# EAGLE board Project_TSC (EAGLE 9.7.0)
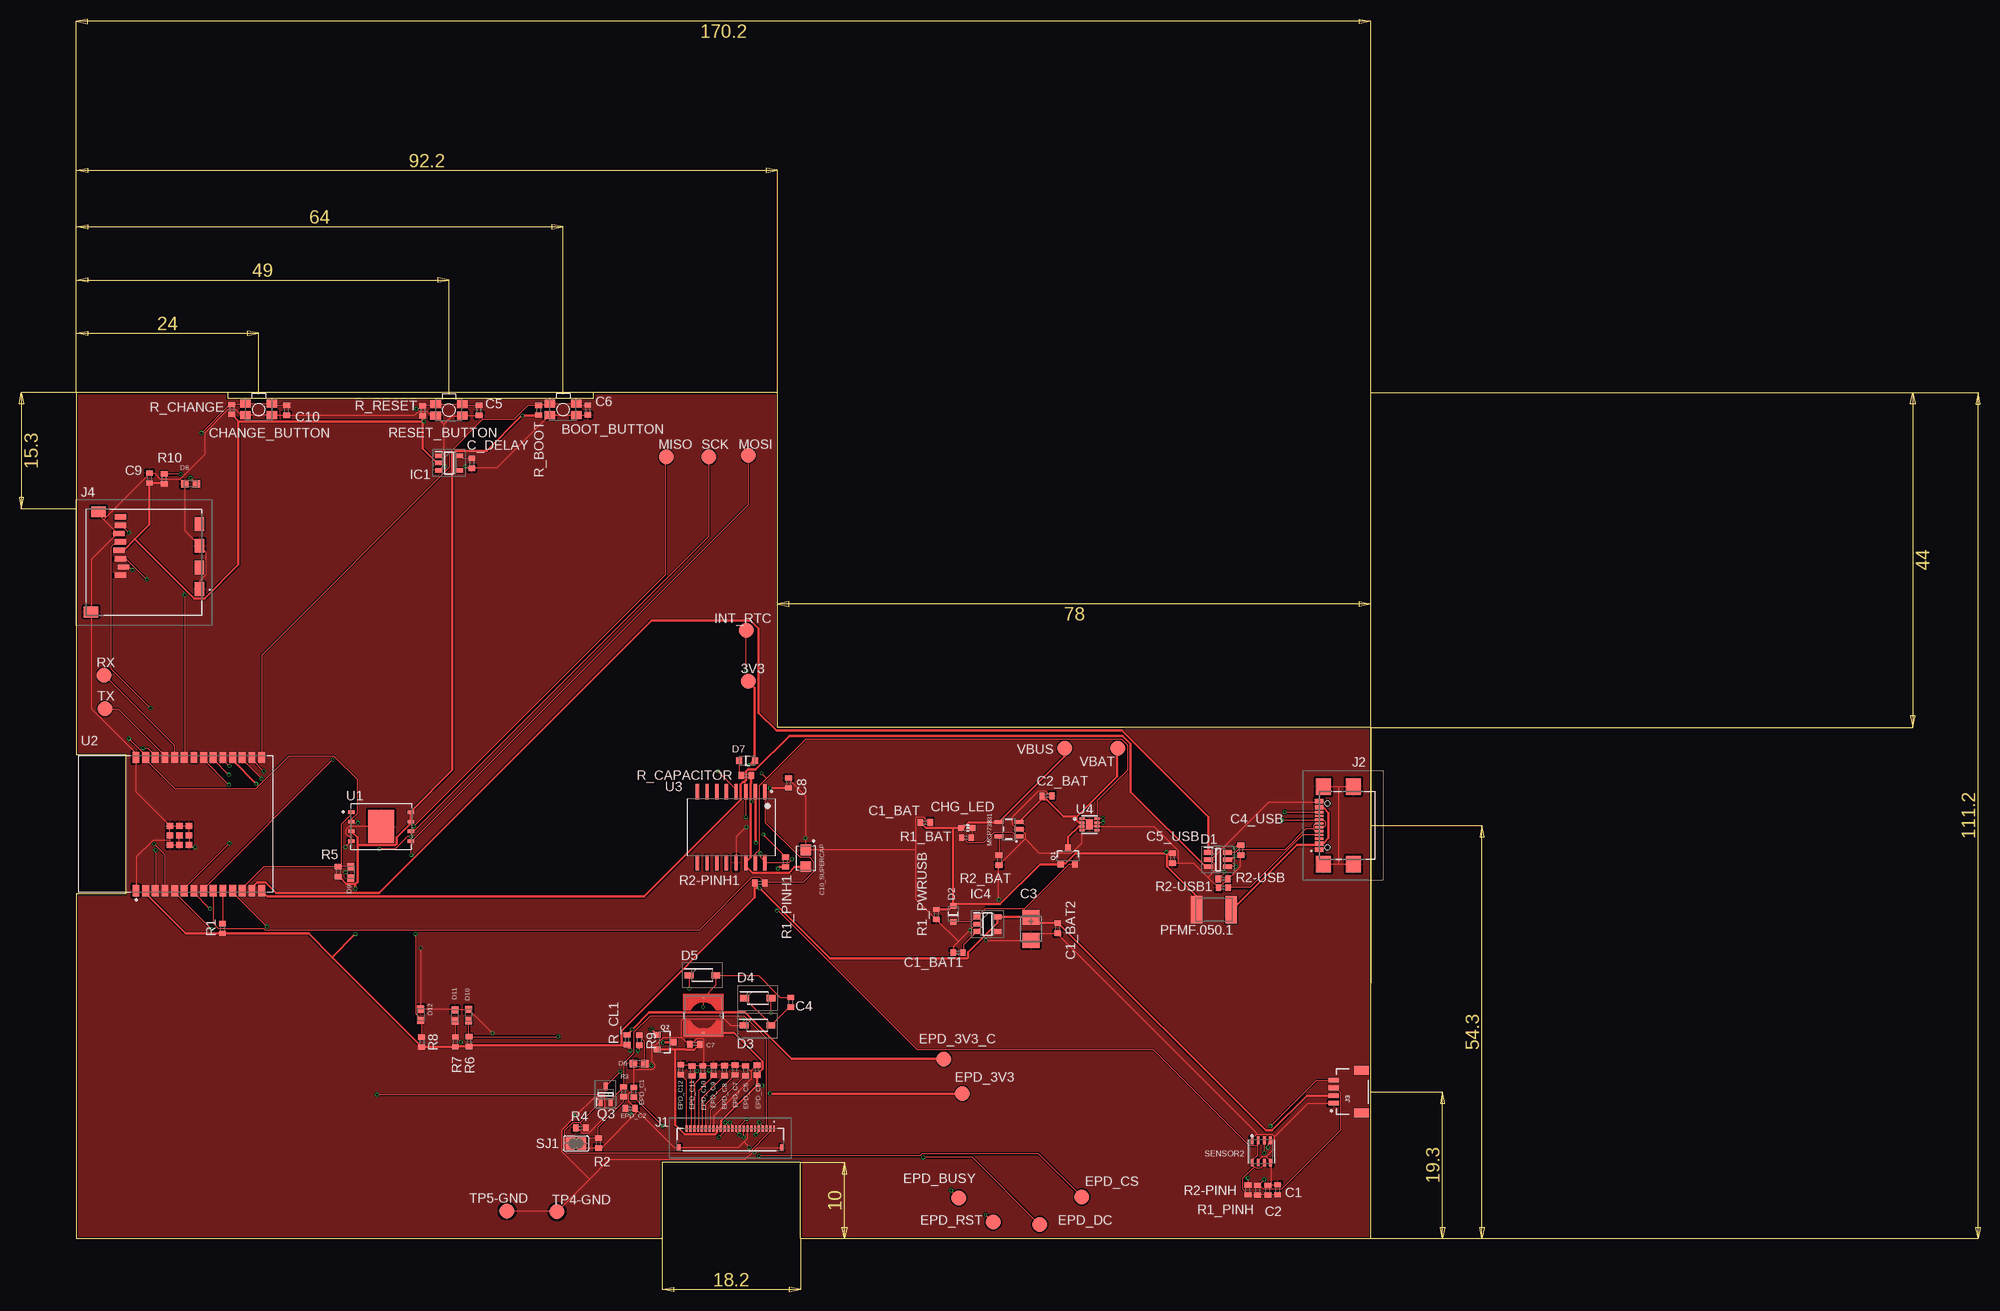
[diagram p1: board, top side]
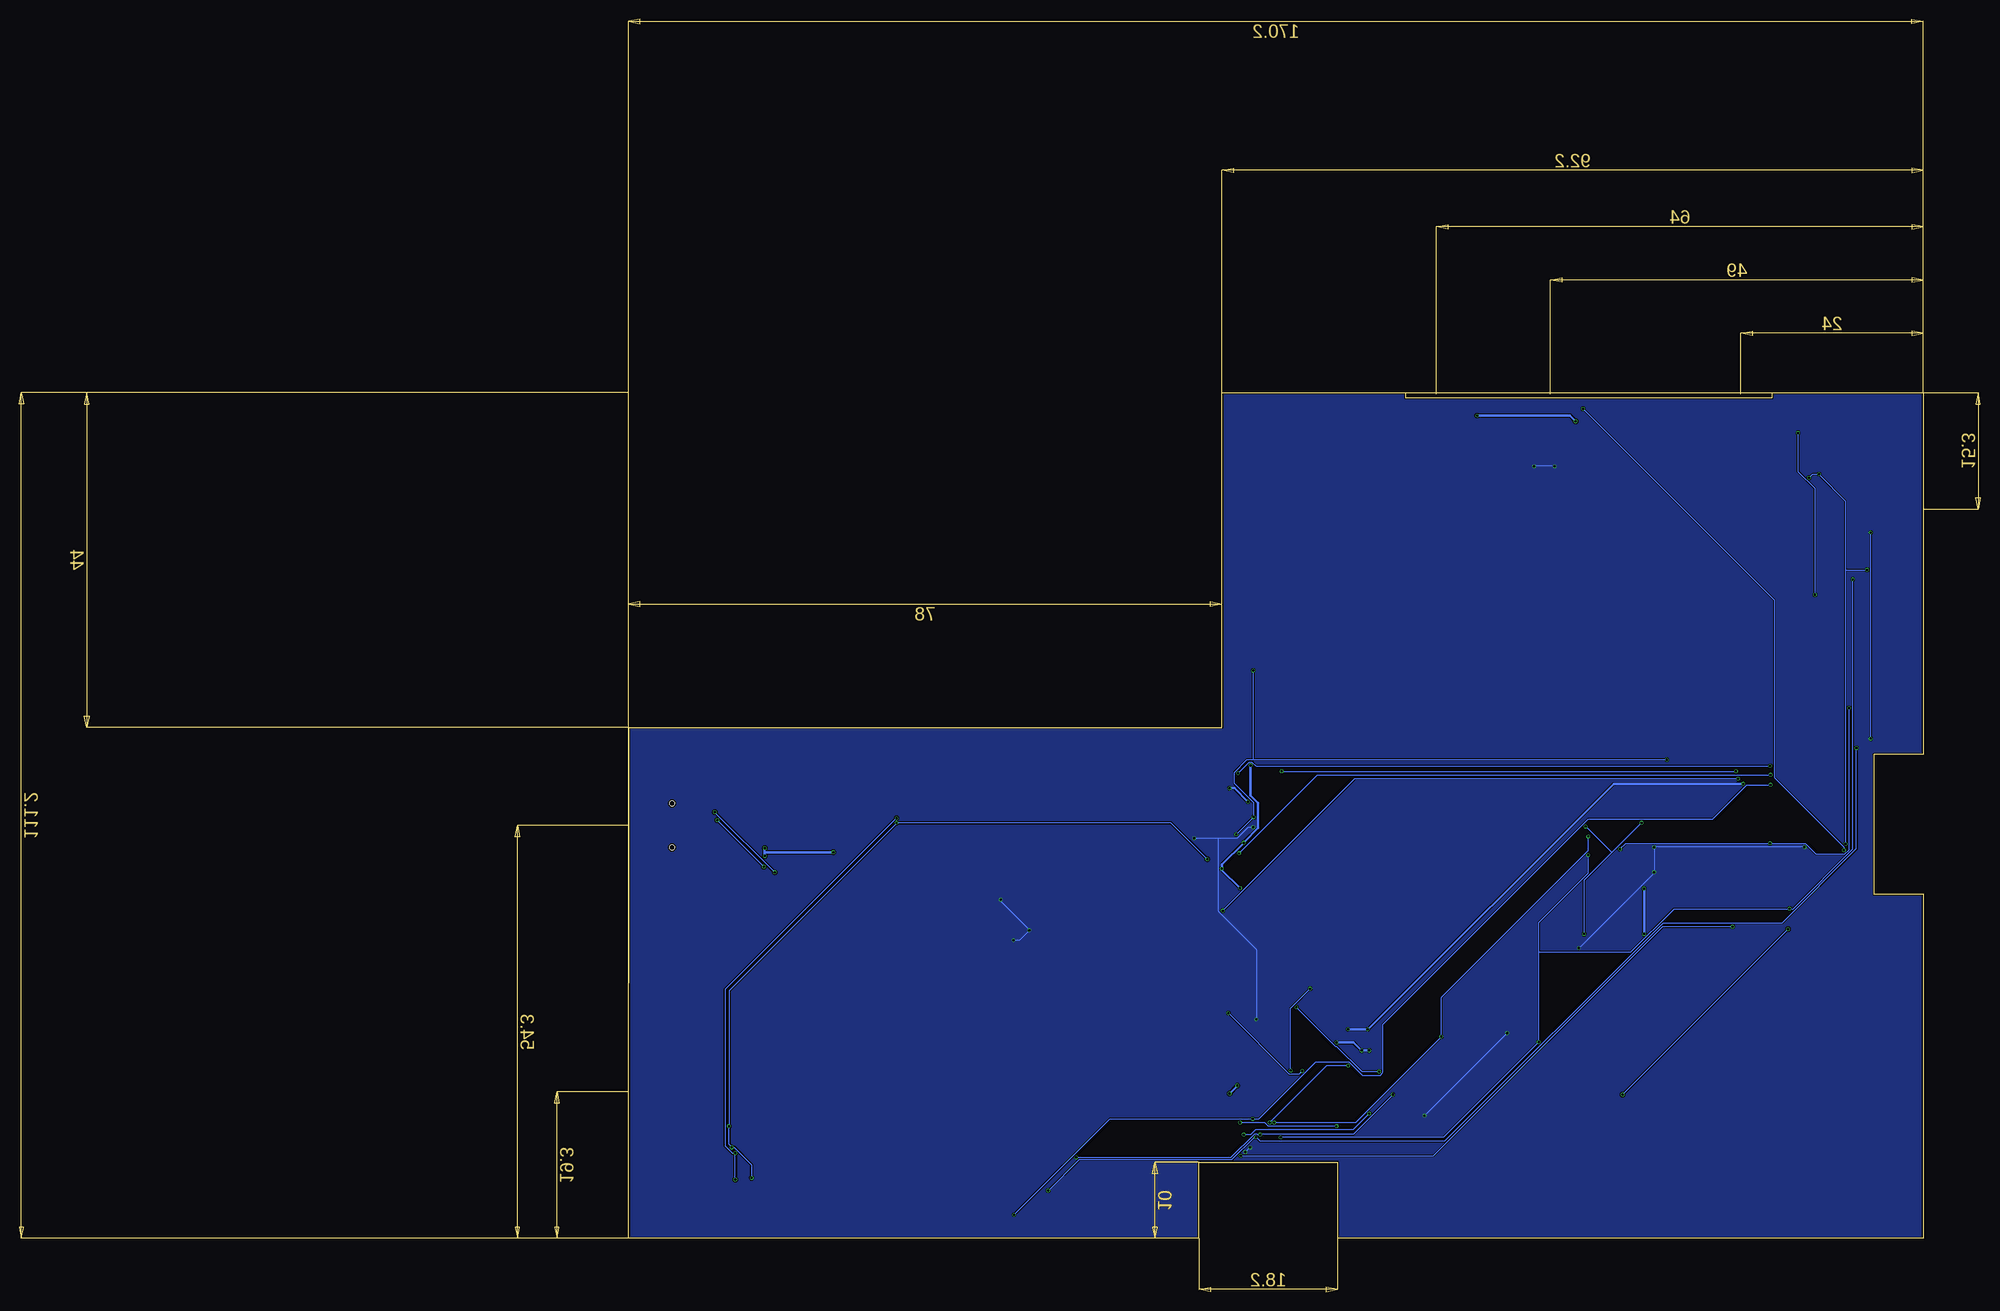
[diagram p2: board, bottom side, seen from below]

Size 170.2 x 111.2 mm. Coordinates in mm from the lower left corner, seen from the top.
Outline: 170.2,67.2 170.2,0 95.2,0 95.2,10 77,10 77,0 0,0 0,45.3 6.5,45.3 6.5,63.6 0,63.6 0,111.2 19.9,111.2
Outline: 170.2,67.2 170.2,111.2
Outline: 68,111.2 92.2,111.2 92.2,67.2 170.2,67.2
Outline: 68,111.2 19.9,111.2
Outline: 19.9,111.2 19.9,110.5 68,110.5 68,111.2
Copper layers (1*16): Top / Bottom
Stack-up Default Layer Stack: Top User Defined 0.035mm / Dielectric-1 User Defined 1.6mm / Bottom User Defined 0.035mm
Design rules: minimum copper width classes=0 0.15mm, minimum copper width classes=1 0.3mm, minimum copper width 5mil, minimum drill size 0.3mm, copper clearance wire_polygon to wire_polygon 5mil, copper clearance wire_polygon to pad_smd 5mil, copper clearance wire_polygon to via 5mil, copper clearance pad_smd to pad_smd 5mil, copper clearance pad_smd to via 5mil, copper clearance via to via 5mil, copper clearance smd to pad (same net) 5mil, copper clearance smd to via (same net) 5mil, copper clearance smd to smd (same net) 5mil, dimension clearance 0.2mm, via restrict clearance 0mil, restrict clearance 0mil, drill distance 6mil, keepout clearance 0mil
Net classes: 0 default: width 0.15 mm; 1 Power: width 0.3 mm

## Footprints (pad centres in the part's own frame; a part is rotated, then mirrored left to right if it is on the bottom)
TP20R = smd 2 x 2: TP 0,0
MYBUTTON = smd 1.4 x 1.05: 1 1.75,0.75; 2 -1.75,0.75; 3 -1.75,-0.75; 4 1.75,-0.75
EAGLE-LTSPICE_C0402 = smd 0.7 x 0.9: 1 -0.65,0; 2 0.65,0
RCL_CT3528 = smd 2 x 2.2: + -1.5,0; - 1.5,0
CAPCP3225X100N = smd 1.4 x 1.4: 1 -1.1,0; 2 1.1,0
ADAFRUIT_CHIP-LED0603 = smd 0.8 x 0.8: A 0,-0.75; C 0,0.75
SOT95P280X145-6N = smd 1.2 x 0.6: 1 -1.25,0.95; 2 -1.25,0; 3 -1.25,-0.95; 4 1.25,-0.95; 5 1.25,0; 6 1.25,0.95
ESP32_WROVER_AVX---SD0805S020S1R0_AVX_SD0805S020S1R0_0 = smd 0.8 x 0.9: 1 -1.05,0; 2 1.05,0
SOD3716X135N = smd 1.15 x 0.8: 1 -1.75,0; 2 1.75,0
DIOC1608X36N = smd 0.97 x 0.94: 1 -0.75,0; 2 0.75,0
SOT95P280X120-5N = smd 0.9 x 0.6: 1 -1.4,0.95; 2 -1.4,0; 3 -1.4,-0.95; 4 1.4,-0.95; 5 1.4,0.95
FH34SRJ24S05SH99 = smd 0.3 x 0.8: 1 5.75,1.45; 2 5.25,1.45; 3 4.75,1.45; 4 4.25,1.45; 5 3.75,1.45; 6 3.25,1.45; 7 2.75,1.45; 8 2.25,1.45; 9 1.75,1.45; 10 1.25,1.45; 11 0.75,1.45; 12 0.25,1.45; 13 -0.25,1.45; 14 -0.75,1.45; 15 -1.25,1.45; 16 -1.75,1.45; 17 -2.25,1.45; 18 -2.75,1.45; 19 -3.25,1.45; 20 -3.75,1.45; 21 -4.25,1.45; 22 -4.75,1.45; 23 -5.25,1.45; 24 -5.75,1.45 | smd 0.4 x 0.8: MP1 6.75,-1.05; MP2 -6.75,-1.05
SAMACSYS_PARTS_USB4110GFA = smd 0.3 x 1.15: A1 -3.35,3.678; A4 -2.55,3.678; A5 -1.25,3.678; A6 -0.25,3.678; A7 0.25,3.678; A8 1.25,3.678; A9 2.55,3.678; A12 3.35,3.678; B1 3.05,3.678; B4 2.25,3.678; B5 1.75,3.678; B6 0.75,3.678; B7 -0.75,3.678; B8 -1.75,3.678; B9 -2.25,3.678; B12 -3.05,3.678 | smd 2.18 x 2: MP1 -5.11,-0.827; MP2 5.11,-0.827; MP3 -5.11,3.103; MP4 5.11,3.103 | hole 0.65: -2.89,2.603; 2.89,2.603
JST04_1MM_RA = smd 0.6 x 1.35: 1 -1.5,0; 2 -0.5,0; 3 0.5,0; 4 1.5,0 | smd 1.2 x 2: NC1 2.8,-3.675; NC2 -2.8,-3.675
112ATAARR03ATTEND = smd 1.8 x 1.2: G1 10.6,10.4; G2 4.9,10.4; S1 7.75,10.4; S2 2.05,10.4 | smd 1.4 x 1.9: G3 13.6,-3.85; G4 0.45,-2.85 | smd 0.7 x 1.5: P1 8.8,0; P2 7.7,0.4; P3 6.6,0; P4 5.5,-0.2; P5 4.4,0; P6 3.3,-0.2; P7 2.2,0; P8 1.1,0
IND_4828-WE-TPC_WRE = smd 0.152 x 0.152: 1 -2.286,0 | smd 0.3 x 0.3: 2 2.286,0
ESP32_WROVER_SPARKFUN-IC-POWER_SOT23-5 = smd 0.55 x 1.2: 1 -0.95,-1.3; 2 0,-1.3; 3 0.95,-1.3; 4 0.95,1.3; 5 -0.95,1.3
ESP32C6_VARISTOR_CT/CN1812 = smd 1.5 x 3.6: 1 -2.25,0; 2 2.25,0
ESP32_WROVER_SPARKFUN-DISCRETESEMI_SOT23-3 = smd 0.8 x 0.9: 1 -0.95,-1; 2 0.95,-1; 3 0,1.1
SOT65P210X110-3N = smd 1.05 x 0.5: 1 -1.05,0.65; 2 -1.05,-0.65; 3 1.05,0
ESP32_WROVER_EAGLE-LTSPICE_R0402 = smd 0.7 x 0.9: 1 -0.65,0; 2 0.65,0
ESP32_WROVER_BME680_PSON80P300X300X100-8N = smd 1.016 x 0.5: 1 1.458,1.2; 2 1.458,0.4; 3 1.458,-0.4; 4 1.458,-1.2; 5 -1.458,-1.22; 6 -1.458,-0.4; 7 -1.458,0.4; 8 -1.458,1.2
SJ = smd 1.168 x 1.6: 1 -0.762,0; 2 0.762,0
SON127P600X800X80-9N = smd 0.94 x 0.44: 1 -3.895,1.905; 2 -3.895,0.635; 3 -3.895,-0.635; 4 -3.895,-1.905; 5 3.895,-1.905; 6 3.895,-0.635; 7 3.895,0.635; 8 3.895,1.905 | smd 3.4 x 4.3: 9 0,0
XCVR_ESP32-C6-WROOM-1-N8 = smd 1.5 x 0.9: 1 -8.75,5.26; 2 -8.75,3.99; 3 -8.75,2.72; 4 -8.75,1.45; 5 -8.75,0.18; 6 -8.75,-1.09; 7 -8.75,-2.36; 8 -8.75,-3.63; 9 -8.75,-4.9; 10 -8.75,-6.17; 11 -8.75,-7.44; 12 -8.75,-8.71; 13 -8.75,-9.98; 14 -8.75,-11.25; 15 8.75,-11.25; 16 8.75,-9.98; 17 8.75,-8.71; 18 8.75,-7.44; 19 8.75,-6.17; 20 8.75,-4.9; 21 8.75,-3.63; 22 8.75,-2.36; 23 8.75,-1.09; 24 8.75,0.18; 25 8.75,1.45; 26 8.75,2.72; 27 8.75,3.99; 28 8.75,5.26 | smd 0.8 x 0.8: 29_1 -2.755,0.79; 29_2 -1.505,0.79; 29_3 -0.255,0.79; 29_4 -2.755,-0.46; 29_5 -1.505,-0.46; 29_6 -0.255,-0.46; 29_7 -2.755,-1.71; 29_8 -1.505,-1.71; 29_9 -0.255,-1.71
SOIC127P1032X265-16N = smd 2.05 x 0.59: 1 -4.655,4.445; 2 -4.655,3.175; 3 -4.655,1.905; 4 -4.655,0.635; 5 -4.655,-0.635; 6 -4.655,-1.905; 7 -4.655,-3.175; 8 -4.655,-4.445; 9 4.655,-4.445; 10 4.655,-3.175; 11 4.655,-1.905; 12 4.655,-0.635; 13 4.655,0.635; 14 4.655,1.905; 15 4.655,3.175; 16 4.655,4.445
SON50P200X200X80-9N = smd 0.76 x 0.27: 1 -0.985,0.75; 4 -0.985,-0.75; 5 0.985,-0.75; 6 0.985,-0.25; 7 0.985,0.25; 8 0.985,0.75 | smd 0.76 x 0.31: 2 -0.985,0.25; 3 -0.985,-0.25 | smd 0.9 x 1.3: 9 0,0

## Placement (x,y rotation side)
3V3  TPTP20R  [TP20R]  88.35,73.24 0 top
BOOT_BUTTON  BOOT_BUTTON  [MYBUTTON]  64,108.97 180 top
C1  100nF  [EAGLE-LTSPICE_C0402]  157.92,6.4 90 top
C1_BAT  4.7uF  [EAGLE-LTSPICE_C0402]  111.6,54.68 0 top
C1_BAT1  4.7uF  [EAGLE-LTSPICE_C0402]  115.93,37.58 180 top
C1_BAT2  4.7uF  [EAGLE-LTSPICE_C0402]  129.02,40.79 270 top
C2  100nF  [EAGLE-LTSPICE_C0402]  156.64,6.35 90 top
C2_BAT  4.7uF  [EAGLE-LTSPICE_C0402]  127.61,58.18 0 top
C3  100uF TANT  [RCL_CT3528]  125.5,40.69 270 top
C4  4.7uF/25V  [EAGLE-LTSPICE_C0402]  93.94,31.05 90 top
C4_USB  100nF  [EAGLE-LTSPICE_C0402]  153.1,51.05 270 top
C5  1uF  [EAGLE-LTSPICE_C0402]  52.97,108.87 270 top
C5_USB  4.7uF  [EAGLE-LTSPICE_C0402]  144.1,49.99 270 top
C6  100nF  [EAGLE-LTSPICE_C0402]  67.26,108.9 270 top
C7  10uF  [EAGLE-LTSPICE_C0402]  81.31,25.54 180 top
C8  100nF  [EAGLE-LTSPICE_C0402]  93.64,59.88 90 top
C9  100nF  [EAGLE-LTSPICE_C0402]  9.64,99.96 90 top
C10  100nF  [EAGLE-LTSPICE_C0402]  27.66,108.86 270 top
C10_SUPERCAP  CPH3225A  [CAPCP3225X100N]  95.92,49.98 270 top
C_DELAY  100nF  [EAGLE-LTSPICE_C0402]  52.02,101.89 270 top
CHANGE_BUTTON  CHANGE_BUTTON  [MYBUTTON]  24,108.97 180 top
CHG_LED  [ADAFRUIT_CHIP-LED0603]  117.05,53.96 270 top
D1  USBLC6-2SC6Y  [SOT95P280X145-6N]  150.09,49.8 0 top
D2  ESP32_WROVER_AVX---SD0805S020S1R0_AVX_SD0805S020S1R0_0_0AVX_SD0805S020S1R0_0_0  [ESP32_WROVER_AVX---SD0805S020S1R0_AVX_SD0805S020S1R0_0]  115.29,42.65 90 top
D3  MBR0530  [SOD3716X135N]  89.56,28 0 top
D4  MBR0530  [SOD3716X135N]  89.6,31.6 0 top
D5  MBR0530  [SOD3716X135N]  82.32,34.61 0 top
D6  PGB1010603MR  [DIOC1608X36N]  73.98,23 0 top
D7  ESP32_WROVER_AVX---SD0805S020S1R0_AVX_SD0805S020S1R0_0_0AVX_SD0805S020S1R0_0_0  [ESP32_WROVER_AVX---SD0805S020S1R0_AVX_SD0805S020S1R0_0]  88.2,62.81 0 top
D8  PGB1010603MR  [DIOC1608X36N]  15.06,99.2 0 top
D9  PGB1010603MR  [DIOC1608X36N]  36.11,48.14 90 top
D10  PGB1010603MR  [DIOC1608X36N]  51.6,29.37 270 top
D11  PGB1010603MR  [DIOC1608X36N]  49.8,29.3 270 top
D12  PGB1010603MR  [DIOC1608X36N]  45.3,29.42 270 top
EPD_3V3  TPTP20R  [TP20R]  116.5,19.04 0 top
EPD_3V3_C  TPTP20R  [TP20R]  114.07,23.57 0 top
EPD_BUSY  TPTP20R  [TP20R]  116.01,5.32 0 top
EPD_C1  1uF/50V  [EAGLE-LTSPICE_C0402]  73.3,19.22 90 top
EPD_C2  1uF/50V  [EAGLE-LTSPICE_C0402]  72.83,17.1 0 top
EPD_C5  1uF/50V  [EAGLE-LTSPICE_C0402]  89.5,22.14 90 top
EPD_C6  1uF/50V  [EAGLE-LTSPICE_C0402]  88,22.05 90 top
EPD_C7  1uF/50V  [EAGLE-LTSPICE_C0402]  86.6,22.16 90 top
EPD_C8  1uF/50V  [EAGLE-LTSPICE_C0402]  85.22,22.08 90 top
EPD_C9  1uF/50V  [EAGLE-LTSPICE_C0402]  83.82,22.09 90 top
EPD_C10  1uF/50V  [EAGLE-LTSPICE_C0402]  82.38,22.05 90 top
EPD_C11  1uF/50V  [EAGLE-LTSPICE_C0402]  80.98,22.03 90 top
EPD_C12  1uF/50V  [EAGLE-LTSPICE_C0402]  79.48,22.19 90 top
EPD_CS  TPTP20R  [TP20R]  132.2,5.44 0 top
EPD_DC  TPTP20R  [TP20R]  126.65,1.84 0 top
EPD_RST  TPTP20R  [TP20R]  120.55,2.14 0 top
IC1  BD5229G-TR  [SOT95P280X120-5N]  49.03,101.95 0 top
IC4  XC6220A331MR-G  [SOT95P280X120-5N]  119.77,41.32 0 top
INT_RTC  TPTP20R  [TP20R]  88.1,79.94 0 top
J1  FH34SRJ-24S-0.5SH_99_  [FH34SRJ24S05SH99]  86,13 0 top
J2  SAMACSYS_PARTS_USB4110-GF-A  [SAMACSYS_PARTS_USB4110GFA]  167.06,54.3 90 top
J3  QWIIC_RIGHT_ANGLE  [JST04_1MM_RA]  165.28,19.3 90 top
J4  112A-TAAR-R03_ATTEND  [112ATAARR03ATTEND]  5.82,95.96 270 top
L1  68uH  [IND_4828-WE-TPC_WRE]  82.45,29.33 270 top
MCP73831  ESP32_WROVER_SPARKFUN-IC-POWER_MCP73831  [ESP32_WROVER_SPARKFUN-IC-POWER_SOT23-5]  122.61,53.81 90 top
MISO  TPTP20R  [TP20R]  77.55,102.72 0 top
MOSI  TPTP20R  [TP20R]  88.37,102.92 0 top
PFMF.050.1  ESP32C6_VARISTORCN1812  [ESP32C6_VARISTOR_CT/CN1812]  149.56,43.2 180 top
Q1  20V/4.2A/52mΩ/1.4W  [ESP32_WROVER_SPARKFUN-DISCRETESEMI_SOT23-3]  130.36,50.26 0 top
Q2  20V/4.2A/52mΩ/1.4W  [ESP32_WROVER_SPARKFUN-DISCRETESEMI_SOT23-3]  77.36,25.82 270 top
Q3  SI1308EDL-T1-GE3  [SOT65P210X110-3N]  69.59,18.95 90 top
R1  10K  [ESP32_WROVER_EAGLE-LTSPICE_R0402]  19.24,40.75 90 top
R1_BAT  200  [ESP32_WROVER_EAGLE-LTSPICE_R0402]  117.02,52.68 0 top
R1_PINH  10K  [ESP32_WROVER_EAGLE-LTSPICE_R0402]  155.28,6.35 90 top
R1_PINH1  10K  [ESP32_WROVER_EAGLE-LTSPICE_R0402]  93.24,49.49 270 top
R1_PWRUSB  100K  [ESP32_WROVER_EAGLE-LTSPICE_R0402]  113.06,42.6 90 top
R2  2.2  [ESP32_WROVER_EAGLE-LTSPICE_R0402]  68.66,12.55 90 top
R2-PINH  10K  [ESP32_WROVER_EAGLE-LTSPICE_R0402]  154,6.39 90 top
R2-PINH1  10K  [ESP32_WROVER_EAGLE-LTSPICE_R0402]  89.87,46.76 180 top
R2-USB  5k1  [ESP32_WROVER_EAGLE-LTSPICE_R0402]  150.74,47.28 0 top
R2-USB1  5k1  [ESP32_WROVER_EAGLE-LTSPICE_R0402]  150.79,46.12 0 top
R2_BAT  2K  [ESP32_WROVER_EAGLE-LTSPICE_R0402]  121.32,49.73 90 top
R3  0.47  [ESP32_WROVER_EAGLE-LTSPICE_R0402]  71.96,19.29 270 top
R4  10K  [ESP32_WROVER_EAGLE-LTSPICE_R0402]  66.33,14.54 180 top
R5  10K  [ESP32_WROVER_EAGLE-LTSPICE_R0402]  34.46,48.21 270 top
R6  10K  [ESP32_WROVER_EAGLE-LTSPICE_R0402]  51.66,25.89 270 top
R7  10K  [ESP32_WROVER_EAGLE-LTSPICE_R0402]  49.86,25.85 270 top
R8  10K  [ESP32_WROVER_EAGLE-LTSPICE_R0402]  45.44,25.81 270 top
R9  10K  [ESP32_WROVER_EAGLE-LTSPICE_R0402]  74.04,26.09 270 top
R10  10K  [ESP32_WROVER_EAGLE-LTSPICE_R0402]  11.56,99.87 270 top
R_BOOT  10K  [ESP32_WROVER_EAGLE-LTSPICE_R0402]  60.8,108.88 90 top
R_CAPACITOR  15  [ESP32_WROVER_EAGLE-LTSPICE_R0402]  88.1,60.86 180 top
R_CHANGE  10K  [ESP32_WROVER_EAGLE-LTSPICE_R0402]  20.46,108.97 90 top
R_CL1  10K  [ESP32_WROVER_EAGLE-LTSPICE_R0402]  72.42,26.12 90 top
R_RESET  10K  [ESP32_WROVER_EAGLE-LTSPICE_R0402]  45.56,108.79 90 top
RESET_BUTTON  RESET BUTTON  [MYBUTTON]  49,108.91 180 top
RX  TPTP20R  [TP20R]  3.69,74.04 0 top
SCK  TPTP20R  [TP20R]  83.19,102.72 0 top
SENSOR2  BME680  [ESP32_WROVER_BME680_PSON80P300X300X100-8N]  155.77,11.44 90 top
SJ1  [SJ]  65.7,12.48 180 top
TP4-GND  TPTP20R  [TP20R]  63.21,3.52 0 top
TP5-GND  GND  [TP20R]  56.63,3.62 0 top
TX  TPTP20R  [TP20R]  3.77,69.64 0 top
U1  W25Q512JVEIQ  [SON127P600X800X80-9N]  40.09,54.16 0 top
U2  ESP32-C6-WROOM-1-N8  [XCVR_ESP32-C6-WROOM-1-N8]  13.13,54.48 90 top
U3  DS3231SN#  [SOIC127P1032X265-16N]  86.1,54.05 270 top
U4  MAX17048G+T10  [SON50P200X200X80-9N]  133.2,54.42 0 top
VBAT  TPTP20R  [TP20R]  136.89,64.42 0 top
VBUS  TPTP20R  [TP20R]  129.95,64.44 0 top

## Tracks (layer width: path | path; a pad name or v marks a point on that pad's centre or on a via)
3V3  (via drill 0.3)
  Top 0.3: R10.2 11.49,99.23 11.43,99.31 9.7,99.31 C9.1 9.63,99.17 9.63,93.83 7.72,91.93 | 7.72,91.93 6.3,90.51 5.68,90.51 J4.P4 | 45.57,107.41 45.57,108.1 R_RESET.1 | 45.57,107.41 45.57,103.81 47.37,102 47.58,102 IC1.2 | 21.4,107.41 20.5,108.31 R_CHANGE.1 | 45.57,107.41 21.4,107.41 | R_BOOT.1 60.73,108.17 v58.66,108.17 58.52,108.1 53.95,103.53 49.86,103.53 49.44,103.11 49.44,61.56 44.04,56.16 U1.8 43.97,56.02 43.97,54.85 U1.7 43.9,54.71 43.9,54.5 42.1,52.7 42.1,51.87 41.97,51.73 36.98,51.73 | v45.7,107.41 45.57,107.41 | 7.72,91.93 15.51,84.14 16.9,84.14 21.33,88.57 21.33,107.27 21.4,107.41 | J3.2 165.23,18.77 161.77,18.77 157.2,14.2 156.37,14.2 129.15,41.41 C1_BAT2.1 129.01,41.48 126.24,41.48 125.55,42.17 C3.+ 125.41,42.24 121.19,42.24 IC4.5 121.12,42.1 121.12,41.48 117.24,37.6 117.24,36.98 117.1,36.84 99.1,36.84 89.96,45.98 v89.82,46.05 89.19,46.05 | 36.7,46.6 35.52,46.6 34.62,47.51 34.49,47.51 R5.2 | 36.7,46.6 36.98,46.88 36.98,51.73 | 36.98,51.73 36.98,52.7 36.22,53.46 U1.3 | U2.2 9.14,45.7 9.14,45.36 14.4,40.1 19.18,40.1 R1.1 19.39,40.1 30.54,40.1 33.66,36.98 | 3V3.TP 88.36,73.2 89.19,72.37 89.19,62.88 D7.2 89.06,62.81 v88.43,62.19 | 71.67,25.41 51.94,25.41 51.8,25.28 R6.2 51.59,25.28 50,25.28 R7.2 45.5,25.21 R8.2 45.36,25.28 33.66,36.98 | 71.67,25.41 72.37,25.41 R_CL1.1 72.44,25.28 72.85,24.86 v72.85,24.72 | v73.82,24.72 74.03,24.93 74.03,25.41 R9.2 | v77.14,25.76 78.39,25.76 Q2.3 | 89.19,46.05 89.19,44.8 71.67,27.29 71.67,25.41 | 89.19,46.05 89.19,46.74 R2-PINH1.2 | v92.24,48.61 92.45,48.82 93.21,48.82 R1_PINH1.2 | v89.33,52.01 89.33,58.66 U3.2 | v36.7,45.98 36.7,46.6
  Top 0.3: 33.66,36.98 v36.7,40.03
  Bottom 0.3: v58.66,108.17 46.47,108.17 v45.7,107.41 | v72.85,24.72 v73.82,24.72 73.96,24.79 74.93,25.76 v77.14,25.76 | v89.82,46.05 92.24,48.48 v92.24,48.61 92.17,48.75 92.17,49.17 v89.33,52.01 89.26,52.15 87.46,53.95 87.46,57.27 88.43,58.24 v88.43,62.19 | v36.7,40.03 v36.7,45.98
32KHZ
  Top 0.15: U3.1 90.58,58.66 90.58,54.71 95.15,50.14 96.4,50.14 96.88,49.65 96.88,48.13 95.56,46.81 90.58,46.81 R2-PINH1.1 90.51,46.81 89.89,47.44 88.78,47.44 81.85,40.51 24.93,40.51 24.72,40.72 18.77,40.72 18.07,41.41 18.07,45.7 U2.9
DN
  Top 0.15: 162.6,53.81 162.81,53.6 163.36,53.6 J2.B7 | 162.6,53.81 162.6,54.29 162.81,54.5 163.36,54.5 J2.A7 | 162.6,53.81 161.56,53.81 158.86,51.11 152.7,51.11 152.35,50.76 151.38,50.76 D1.6
DP  (via drill 0.3)
  Top 0.15: J2.A6 163.43,54.08 163.98,54.08 164.19,54.29 164.19,54.78 163.98,54.98 163.43,54.98 J2.B6 163.36,54.98 v158.51,54.98 | v152.42,48.89 151.38,48.89 D1.4
  Bottom 0.15: v158.51,54.98 v152.42,48.89
EDP_CS  (via drill 0.3)
  Top 0.15: v25.07,41 20.57,45.5 20.57,45.7 U2.11 | v89.75,10.87 110.94,10.87 111.22,11.15 126.52,11.15 132.2,5.47 EPD_CS.TP
  Bottom 0.15: v25.07,41 34.28,41 64.4,10.87 v89.75,10.87
EPD_3V3  (via drill 0.3)
  Top 0.3: 78.74,24.86 80.12,24.86 80.19,24.79 81.23,24.79 81.92,25.48 C7.1 | 78.74,24.86 76.38,24.86 Q2.2 | 89.47,20.15 89.47,21.47 EPD_C5.1 89.54,21.61 90.23,22.3 90.23,23.27 86.49,27.01 82.48,27.01 L1.2 | 89.47,20.15 84.76,15.44 84.76,14.61 J1.15 84.69,14.47 84.28,14.47 J1.16 84.21,14.34 84.21,13.92 84,13.71 79.98,13.71 78.74,14.96 78.74,24.86 | v91.2,19.04 116.48,19.04 EPD_3V3.TP | v90.16,20.08 89.61,20.08 89.47,20.15
  Bottom 0.3: v90.16,20.08 v91.2,19.04
EPD_3V3_C  (via drill 0.3)
  Top 0.3: v75.62,27.49 76.31,26.8 Q2.1 | R_CL1.2 72.44,26.8 73.06,27.42 v73.06,27.49 73.2,27.56 75.34,29.71 87.95,29.71 94.04,23.61 114.06,23.61 EPD_3V3_C.TP | v23.68,59.76 20.57,62.88 U2.18
  Bottom 0.3: v75.62,27.49 v73.06,27.49 72.92,27.56 40.72,59.76 v23.68,59.76
EPD_BUSY  (via drill 0.3)
  Top 0.15: v87.74,13.3 87.74,14.4 J1.9 | v115.02,6.3 115.99,5.33 EPD_BUSY.TP | v8.79,64.47 9.42,64.47 10.39,63.5 10.39,63.29 U2.26
  Bottom 0.15: v115.02,6.3 110.94,10.39 90.86,10.39 87.95,13.3 v87.74,13.3 87.67,13.3 87.19,12.81 62.88,12.81 34.21,41.48 18.56,41.48 8.79,51.24 v8.79,64.47
EPD_CS  (via drill 0.3)
  Top 0.15: v85.94,15.23 86.22,14.96 86.22,14.47 J1.12 | v75.62,22.71 75.07,22.71 74.79,22.99 D6.2 74.72,23.06 74.72,25.9 74.1,26.52 74.1,26.73 R9.1
  Bottom 0.15: v85.94,15.23 78.46,22.71 v75.62,22.71
EPD_DC  (via drill 0.3)
  Top 0.15: v87.19,13.64 86.77,14.06 86.77,14.4 J1.11 | v111.35,10.66 117.79,10.66 126.59,1.87 EPD_DC.TP | v17.8,40.65 12.95,45.5 12.95,45.7 U2.5 | v69.73,18.91 v39.54,18.91
  Bottom 0.15: v111.35,10.66 91,10.66 87.88,13.78 87.6,13.78 87.46,13.64 v87.19,13.64 87.12,13.64 86.98,13.78 74.86,13.78 v69.73,18.91 | v39.54,18.91 v17.8,40.65
EPD_RST  (via drill 0.3)
  Top 0.15: v88.16,15.72 87.25,14.82 87.25,14.47 J1.10 | v119.53,3.12 120.5,2.15 EPD_RST.TP | v20.08,59.62 16.76,62.95 U2.21
  Bottom 0.15: v119.53,3.12 106.92,15.72 v88.16,15.72 87.32,15.72 79.84,23.2 75.48,23.2 73.75,21.47 71.4,21.47 71.05,21.81 71.05,28.12 44.04,55.12 27.7,55.12 23.2,59.62 v20.08,59.62
FLASH_CS
  Top 0.15: R5.1 34.49,48.89 36.08,48.89 D9.2 | U1.1 36.15,56.02 36.15,55.75 34.9,54.5 34.9,48.96 R5.1 | U2.12 21.88,45.77 21.88,46.05 24.65,48.82 34.42,48.82 R5.1
GDR
  Top 0.15: 66.27,15.23 65.23,15.23 64.13,14.13 64.13,11.56 64.4,11.29 88.43,11.29 91.2,14.06 91.2,14.4 J1.2 | 66.27,15.23 66.97,14.54 R4.1 | 66.27,15.23 68.9,17.87 Q3.1
GND  (via drill 0.3)
  Top 0.15: U1.9 40.03,54.15 35.87,54.15 35.46,53.74 35.46,53.25 36.15,52.56 36.15,52.28 U1.4 36.15,52.22 v35.39,51.45 | v35.39,48.13 36.08,47.44 D9.1 | v45.29,38.16 45.29,30.19 D12.1 45.36,30.12 49.79,30.12 D11.1 49.86,30.05 51.59,30.05 D10.1 51.66,30.05 v54.71,27.01 | 12.33,52.35 12.33,52.91 U2.29_2 12.33,53.05 12.33,54.22 U2.29_3 | 12.33,52.35 12.33,51.73 U2.29_1 12.4,51.73 13.57,51.73 U2.29_4 13.57,51.8 13.57,52.91 U2.29_5 | U2.29_3 12.4,54.22 13.57,54.22 U2.29_6 13.64,54.22 14.82,54.22 U2.29_9 14.82,54.15 14.82,53.05 U2.29_8 14.89,52.91 14.89,51.73 U2.29_7 14.96,51.73 15.23,51.45 v15.65,51.45 | 12.33,52.35 10.11,52.35 7.89,50.14 7.89,45.77 U2.1 | U2.29_3 12.33,54.29 7.89,58.72 7.89,63.23 U2.28 7.83,63.29 7.83,63.85 2.01,69.67 2.01,82.34 J4.G3 2.01,82.41 2.01,89.26 5.4,92.66 J4.P6 5.61,92.73 5.4,92.73 3.64,94.49 | C6.2 67.24,108.24 65.79,108.24 BOOT_BUTTON.2 65.72,108.24 62.33,108.24 BOOT_BUTTON.1 62.19,108.17 55.26,101.24 52.08,101.24 C_DELAY.2 52.01,101.31 51.38,101.31 v51.18,101.52 | 3.64,94.49 2.98,95.15 2.98,95.5 J4.G4 | C5.2 52.91,108.17 RESET_BUTTON.2 50.69,108.1 49.44,108.1 48.41,107.06 48.34,107.06 | 48.34,101.59 47.78,101.04 47.64,101.04 IC1.3 | 48.34,107.06 48.34,101.59 | 48.34,107.06 47.3,108.1 RESET_BUTTON.1 47.23,108.17 46.67,108.17 46.12,108.72 45.01,108.72 44.53,108.24 27.7,108.24 C10.2 27.63,108.24 25.76,108.24 CHANGE_BUTTON.2 25.69,108.24 22.3,108.24 CHANGE_BUTTON.1 22.23,108.24 21.68,108.24 20.98,108.93 19.94,108.93 16.97,105.95 16.97,103.11 13.71,99.86 13.71,99.79 | 9.7,100.55 10.39,100.55 11.15,99.79 13.71,99.79
  Top 0.15: 13.71,99.79 14.27,99.23 D8.1 14.34,99.17 14.34,93 16.2,91.13 J4.G2 16.27,91 17.04,90.23 17.04,87.19 16.27,86.42 16.27,85.39 J4.G1 | 9.7,100.55 3.64,94.49 | 9.7,100.55 C9.2 | v48.48,101.52 48.41,101.59 48.34,101.59 | 88.71,21.95 88.71,20.98 83.79,16.07 83.79,14.47 J1.17 | 88.71,21.95 88.02,22.64 EPD_C6.2 87.95,22.71 86.56,22.71 EPD_C7.2 86.56,22.78 85.25,22.78 EPD_C8.2 85.18,22.78 83.86,22.78 EPD_C9.2 83.79,22.78 82.82,22.78 82.61,22.99 EPD_C10.2 | EPD_C5.2 89.47,22.78 88.71,22.02 88.71,21.95 | EPD_C10.2 82.34,22.71 81.02,22.71 EPD_C11.2 81.02,22.78 79.5,22.78 EPD_C12.2 | EPD_C10.2 82.34,22.78 82.55,22.99 82.55,26.11 82.41,26.25 81.58,26.25 80.88,25.55 80.68,25.55 C7.2 80.61,25.55 80.47,25.55 79.57,26.45 | 79.57,26.45 79.57,28.67 79.78,28.88 85.18,28.88 86.01,28.05 87.81,28.05 D3.1 87.67,28.12 v87.67,28.81 | SJ1.1 66.48,12.46 67.03,11.91 68.63,11.91 R2.1 68.7,11.91 69.04,11.91 73.82,16.69 EPD_C2.2 | 73.27,22.23 73.27,22.99 D6.1 | 73.27,22.23 73.27,19.88 EPD_C1.2 73.27,19.8 73.27,19.67 72.64,19.04 72.64,18 73.47,17.17 EPD_C2.2 | EPD_C2.2 73.54,17.04 78.6,11.98 79.22,11.98 J1.MP2 79.29,11.98 87.05,11.98 87.77,12.71 | 87.77,12.71 88.22,13.16 88.22,14.4 J1.8 | 79.57,26.45 77.21,26.45 76.24,25.48 75.83,25.48 75.69,25.35 75.69,23.27 76.11,22.85 76.11,22.58 75.76,22.23 73.27,22.23 | 89.02,11.46 87.95,10.39 70.08,10.39 67.48,7.79 | 89.02,11.46 89.47,11.91 92.73,11.91 J1.MP1 | 67.48,7.79 63.23,3.53 TP4-GND.TP 63.23,3.6 56.65,3.6 TP5-GND.TP | 65.68,16.1 63.85,14.27 63.85,11.43 67.48,7.79 | 65.68,16.1 68.21,18.63 69.32,18.63 69.46,18.49 69.46,15.93 67.38,13.85 66.55,13.85 65.93,14.47 65.72,14.47 R4.2
  Top 0.15: v88.5,11.98 87.77,12.71 | 89.02,11.46 v89.12,11.36 | J2.B12 163.36,51.24 163.36,50.97 J2.A1 163.43,50.9 163.43,49.72 163.91,49.24 J2.MP3 163.98,49.24 165.92,49.24 | 165.92,49.24 167.86,49.24 J2.MP1 | 165.92,59.42 163.98,59.42 J2.MP4 163.91,59.35 163.43,58.86 163.43,57.69 J2.A12 163.36,57.62 163.36,57.41 J2.B1 163.29,57.41 156.78,57.41 149.16,49.79 D1.2 148.89,49.79 149.09,49.79 149.65,49.24 149.65,48.34 148.78,47.47 | 165.92,59.42 167.86,59.42 J2.MP2 | 165.92,59.42 165.92,49.24 | 144.8,49.31 146.95,49.31 148.78,47.47 | 144.8,49.31 144.11,49.31 C5_USB.2 | 148.78,47.47 R2-USB1.1 150.2,46.12 151.38,47.3 R2-USB.2 151.45,47.3 153.04,48.89 153.04,50.34 C4_USB.2 | U4.9 133.24,54.36 132.61,53.74 132.27,53.74 U4.4 132.2,53.6 132.2,52.01 130.88,50.69 126.59,50.69 124.79,52.49 124.72,52.49 | U4.1 132.27,55.12 132.61,55.12 133.17,54.57 133.17,54.43 U4.9 | U4.9 133.31,54.36 133.44,54.22 134.14,54.22 U4.6 134.21,54.15 141.69,54.15 144.8,51.04 144.8,49.31 | 124.72,52.49 121.33,49.1 R2_BAT.1 121.26,49.03 v121.26,44.53 | 124.72,52.49 124.72,53.25 124.17,53.81 123.96,53.81 MCP73831.2 123.89,53.88 123.61,53.88 123.06,54.43 123.06,55.4 126.52,58.86 127.42,58.86 128.04,58.24 128.25,58.24 C2_BAT.2 | 95.91,52.63 95.91,51.11 C10_SUPERCAP.1 95.98,51.11 110.39,51.11 | 95.91,52.63 95.91,58.1 93.69,60.32 93.69,60.52 C8.2 | v88.09,54.08 86.77,52.77 86.77,49.44 U3.13 | v95.84,52.63 95.91,52.63 | C1.2 157.89,6.99 C2.2 157.06,7.06 157.06,9.97 SENSOR2.5 156.99,10.04 156.99,10.18 156.44,10.73 | 156.44,10.73 155.88,10.73 155.4,10.25 155.4,10.04 SENSOR2.7 | 155.05,13.64 154.63,13.23 154.63,12.95 SENSOR2.1
  Top 0.15: 155.05,13.64 157.27,13.64 157.47,13.43 | 157.47,13.43 157.47,11.84 156.44,10.8 156.44,10.73 | J3.1 165.23,17.8 161.91,17.8 157.54,13.43 157.47,13.43 | 117.48,40.55 118.21,41.27 118.35,41.27 IC4.2 | 117.48,40.55 115.96,39.02 | 115.96,39.02 115.3,38.36 115.3,37.6 C1_BAT1.2 | 115.96,39.02 113.08,41.9 R1_PWRUSB.1 113.02,41.97 110.39,44.6 110.39,51.11 | 110.39,51.11 110.39,55.26 110.52,55.4 111.35,55.4 112.05,54.71 112.19,54.71 C1_BAT.2 | v119.59,39.2 125.48,39.2 C3.- 125.55,39.2 126.45,40.1 129.01,40.1 C1_BAT2.2 129.01,40.03 155.05,13.99 155.05,13.64 | v117.52,40.51 117.48,40.55 | v65.58,16.14 65.65,16.14 65.68,16.1
  Bottom 0.15: v45.29,38.16 35.39,48.06 v35.39,48.13 v35.39,51.45 v15.65,51.45 | v48.48,101.52 v51.18,101.52 | v89.12,11.36 v88.5,11.98 | v88.09,54.08 88.71,54.08 90.16,52.63 92.73,52.63 | v95.84,52.63 92.73,52.63 | v119.59,39.2 118.83,39.2 v117.52,40.51 117.52,40.58 121.26,44.32 v121.26,44.53 | v87.67,28.81 87.67,38.02 92.73,43.07 92.73,52.63 | v65.58,16.14 v54.71,27.01
  pour Top: 0,111.2 19.9,111.2 19.9,110.5 68,110.5 68,111.2 92.2,111.2 92.2,67.2 170.2,67.2 170.2,0 95.2,0 95.2,10 77,10 77,0 0,0 0,45.3 6.5,45.3 6.5,63.6 0,63.6
  pour Bottom: 0,111.2 19.9,111.2 19.9,110.5 68,110.5 68,111.2 92.2,111.2 92.2,67.2 170.2,67.2 170.2,0 95.2,0 95.2,10 77,10 77,0 0,0 0,45.3 6.5,45.3 6.5,63.6 0,63.6
GPIO8
  Top 0.15: R1.2 19.25,41.41 19.25,45.7 U2.10
I2C_PW  (via drill 0.3)
  Top 0.15: C1.1 157.89,5.75 156.64,5.75 C2.1 156.57,5.75 155.33,5.75 R1_PINH.1 155.26,5.75 154.01,5.75 R2-PINH.1 154.01,5.82 153.32,6.51 153.32,7.89 154.88,9.45 | 154.88,9.45 155.12,9.21 155.67,9.21 156.16,9.7 156.16,9.97 SENSOR2.6 | 154.88,9.45 154.63,9.7 154.63,9.97 SENSOR2.8 154.63,10.04 154.63,10.32 155.33,11.01 155.33,12.19 | 155.33,12.19 155.33,12.88 SENSOR2.2 | v24.38,60.45 21.88,62.95 21.88,63.23 U2.17 | v92.1,43.07 92.31,43.07 110.59,24.79 141.62,24.79 154.22,12.19 155.33,12.19
  Bottom 0.15: v24.38,60.45 74.72,60.45 v92.1,43.07
INT_RTC  (via drill 0.3)
  Top 0.15: v90.3,53.12 93.21,50.21 R1_PINH1.1 | v88.02,55.4 88.02,58.66 U3.3 | v33.73,62.95 16.76,45.98 16.76,45.77 U2.8 | v88.09,74.65 88.09,79.92 INT_RTC.TP
  Bottom 0.15: v90.3,53.12 v88.02,55.4 88.02,57.27 90.58,59.83 90.58,61.29 88.92,62.95 88.09,62.95 | 88.09,62.95 v33.73,62.95 | 88.09,62.95 v88.09,74.65
IO/BOOT
  Top 0.15: C6.1 67.24,109.55 65.93,109.55 65.79,109.69 BOOT_BUTTON.3 65.72,109.76 62.26,109.76 BOOT_BUTTON.4 62.19,109.69 62.05,109.55 60.8,109.55 R_BOOT.2 60.73,109.48 59.35,109.48 57.48,107.61 53.39,107.61 49.03,103.25 49.03,101.31 24.38,76.66 U2.15
IO/CHANGE  (via drill 0.3)
  Top 0.15: C10.1 27.63,109.55 25.9,109.55 25.76,109.69 CHANGE_BUTTON.3 25.69,109.76 22.3,109.76 CHANGE_BUTTON.4 22.23,109.69 22.16,109.62 20.5,109.62 R_CHANGE.2 20.43,109.55 20.15,109.55 v16.48,105.88 | v14.27,84.62 14.27,63.29 U2.23
  Bottom 0.15: v14.27,84.62 14.27,98.61 16.48,100.83 v16.48,105.88
MISO  (via drill 0.3)
  Top 0.15: R8.1 45.43,26.52 45.43,28.6 45.36,28.67 D12.2 45.29,28.74 45.29,28.88 44.6,29.57 v44.6,40.03 | v6.92,92.8 6.03,93.69 5.82,93.69 J4.P7 | v6.92,65.72 9.07,63.57 9.07,63.29 U2.27 9.14,62.95 12.95,59.14 23.68,59.14 27.98,63.43 33.86,63.43 36.91,60.39 36.91,55.82 36.22,55.12 36.22,54.85 U1.2 36.29,54.85 36.49,54.64 v37.05,54.64 | v44.39,54.15 77.49,87.25 77.49,102.7 MISO.TP
  Bottom 0.15: v6.92,65.72 v6.92,92.8 | v44.6,40.03 44.6,47.09 40.96,50.73 | v37.05,54.64 40.96,50.73 | 40.96,50.73 v44.39,54.15
MOSI  (via drill 0.3)
  Top 0.15: v84.48,13.3 85.25,14.06 85.25,14.4 J1.14 | v50.55,25.83 49.86,26.52 R7.1 49.86,28.53 D11.2 | v44.04,50.41 44.04,52.22 U1.5 44.11,52.22 88.36,96.47 88.36,102.91 MOSI.TP | v17.59,43.35 15.51,45.43 15.51,45.7 U2.7 | v9.28,86.63 6.58,89.33 5.82,89.33 J4.P3
  Bottom 0.15: v84.48,13.3 63.09,13.3 v50.55,25.83 50.55,37.67 | v44.04,50.41 44.04,48.06 50.55,41.55 50.55,37.67 | 50.55,37.67 38.43,37.67 32.76,43.35 v17.59,43.35 17.11,43.35 9.28,51.18 v9.28,86.63
N$1
  Top 0.15: R2-USB1.2 154.29,46.12 161.21,53.05 163.36,53.05 J2.A5
N$2
  Top 0.15: C1_BAT1.1 116.62,37.6 116.62,38.57 118.35,40.3 IC4.3 118.42,40.37 118.83,40.79 118.9,40.79 119.04,40.93 119.04,41.76 118.49,42.31 IC4.1 | D2.1 115.3,41.62 117.59,41.62 118.21,42.24 118.35,42.24 IC4.1 | Q1.2 131.3,49.24 130.54,49.24 124.72,43.42 119.53,43.42 118.42,42.31 IC4.1
N$3
  Top 0.15: R1_BAT.1 116.41,52.63 116.62,52.63 117.24,52.01 119.25,52.01 120.63,53.39 123.13,53.39 123.61,52.91 123.89,52.91 MCP73831.1
N$4  (via drill 0.3)
  Top 0.15: v150.97,48.13 150.13,47.3 R2-USB.1 | v158.86,56.02 163.36,56.02 J2.B5
  Bottom 0.15: v158.86,56.02 v150.97,48.13
N$5
  Top 0.15: CHG_LED.C 117.79,53.95 117.79,52.77 117.72,52.7 R1_BAT.2
N$6
  Top 0.15: J1.24 80.19,14.47 80.19,20.84 79.5,21.54 EPD_C12.1
N$7
  Top 0.15: R2_BAT.2 121.33,50.41 121.33,52.84 MCP73831.5
N$8
  Top 0.15: C4.1 93.9,30.33 93.63,30.33 91.34,28.05 D3.2 91.34,28.12 87.88,31.58 D4.1
N$9
  Top 0.15: C_DELAY.1 52.01,102.56 50.76,102.56 50.48,102.84 IC1.5
N$10
  Top 0.15: J1.22 81.3,14.47 81.3,20.36 82.34,21.4 EPD_C10.1
N$12
  Top 0.15: J1.20 82.27,14.47 82.27,18.49 85.18,21.4 EPD_C8.1
N$13
  Top 0.15: J1.19 82.75,14.47 82.75,17.66 86.56,21.47 EPD_C7.1
N$14
  Top 0.15: J1.18 83.31,14.47 83.31,16.76 87.95,21.4 EPD_C6.1
N$16  (via drill 0.3)
  Top 0.15: v89.33,13.64 89.75,14.06 89.75,14.4 J1.5 | v72.85,16.41 72.23,17.04 EPD_C2.1
  Bottom 0.15: v89.33,13.64 88.43,13.64 87.81,14.27 75,14.27 v72.85,16.41
N$17  (via drill 0.3)
  Top 0.15: v89.82,15.23 90.23,14.82 90.23,14.47 J1.4 | v77.14,14.75 73.34,18.56 EPD_C1.1
  Bottom 0.15: v89.82,15.23 86.56,15.23 86.08,14.75 v77.14,14.75
N$22
  Top 0.15: D7.1 87.19,62.81 87.19,61.08 87.39,60.87 R_CAPACITOR.2
PREVGH  (via drill 0.3)
  Top 0.15: J1.21 81.78,14.47 81.78,19.39 83.79,21.4 EPD_C9.1 v83.17,22.09 | v80.61,32.83 80.61,34.56 D5.1
  Bottom 0.15: v80.61,32.83 83.17,30.26 v83.17,22.09
PREVGL  (via drill 0.3)
  Top 0.15: J1.23 80.81,14.47 80.81,21.19 80.95,21.33 EPD_C11.1 81.02,21.4 v81.65,22.02 | v91.34,29.64 91.34,31.58 D4.2
  Bottom 0.15: v91.34,29.64 83.31,21.61 82.06,21.61 v81.65,22.02
RESE
  Top 0.15: J1.3 90.72,14.47 90.72,26.38 87.81,29.29 75.48,29.29 73.34,27.15 73.34,24.38 72.02,23.06 72.02,19.94 R3.1 71.95,19.88 70.29,18.21 70.29,17.94 Q3.2
RESE'
  Top 0.15: SJ1.2 64.96,12.53 64.96,12.67 65.79,13.5 67.17,13.5 67.45,13.23 68.63,13.23 R2.2 68.63,13.3 68.63,14.68 71.95,18 71.95,18.63 R3.2
RESET  (via drill 0.3)
  Top 0.15: C5.1 52.91,109.55 50.83,109.55 50.76,109.62 RESET_BUTTON.3 50.69,109.69 47.3,109.69 RESET_BUTTON.4 47.23,109.62 47.09,109.48 45.57,109.48 R_RESET.2 45.5,109.42 45.15,109.07 v44.74,109.07 | v10.46,51.04 10.46,45.77 U2.3
  Bottom 0.15: v10.46,51.04 10.46,51.45 19.6,60.59 19.6,83.93 v44.74,109.07
RTC_RST  (via drill 0.3)
  Top 0.15: v24.65,61.42 23.13,62.95 23.13,63.23 U2.16 | v84.35,61.42 86.7,59.07 86.7,58.72 U3.4
  Bottom 0.15: v84.35,61.42 v24.65,61.42
RX
  Top 0.15: U2.24 12.88,63.29 12.88,64.89 3.74,74.03 RX.TP
SCK  (via drill 0.3)
  Top 0.15: v85.32,15.23 85.73,14.82 85.73,14.47 J1.13 | v63.36,26.52 51.66,26.52 R6.1 51.59,26.59 51.59,28.6 D10.2 | v20.15,51.94 14.27,46.05 14.27,45.77 U2.6 | v39.89,51.18 41.97,51.18 43.28,52.49 43.28,52.56 43.56,52.84 v44.04,52.84 44.04,53.46 U1.6 44.11,53.46 44.32,53.46 83.17,92.31 83.17,102.7 SCK.TP | v9.76,69.73 4.64,74.86 4.64,90.92 5.26,91.55 5.75,91.55 J4.P5
  Bottom 0.15: v85.32,15.23 74.65,15.23 v63.36,26.52 63.36,31.72 44.04,51.04 v44.04,52.84 | v39.89,51.18 39.13,51.94 v20.15,51.94 15.51,51.94 14.13,50.55 10.32,50.55 9.76,51.11 v9.76,69.73
SCL  (via drill 0.3)
  Top 0.15: v154.01,7.96 154.01,7.06 R2-PINH.2 | v156.64,11.98 156.64,12.6 156.92,12.88 SENSOR2.4 | v156.99,14.75 163.01,20.77 165.23,20.77 J3.4 | v134.97,54.64 134.21,54.64 U4.7 | v94.11,49.86 93.69,49.44 90.58,49.44 U3.16 90.58,49.51 89.96,50.14 v89.96,50.62 | v20.08,60.94 18.07,62.95 18.07,63.23 U2.20
  Bottom 0.15: v154.01,7.96 154.01,9.7 156.3,11.98 v156.64,11.98 156.64,12.05 156.99,12.4 v156.99,14.75 156.99,32.55 134.97,54.57 v134.97,54.64 98.89,54.64 v94.11,49.86 | v20.08,60.94 79.64,60.94 v89.96,50.62
SDA  (via drill 0.3)
  Top 0.15: J3.3 165.3,19.74 165.65,19.74 166.2,19.18 166.2,14.2 158.44,6.44 156.09,6.44 155.54,6.99 155.33,6.99 R1_PINH.2 155.47,7.06 v156.16,7.76 | v156.16,11.22 156.16,12.88 SENSOR2.3 | 90.75,60.49 89.82,59.55 89.82,51.11 89.33,50.62 89.33,49.44 U3.15 | 90.75,60.49 95.91,65.65 137.39,65.65 138.15,64.89 138.15,61.49 134.21,57.55 134.21,55.19 U4.8 134.28,55.26 v134.97,55.26 | v20.15,62.12 19.32,62.95 19.32,63.23 U2.19 | 90.75,60.49 v90.09,61.15
  Bottom 0.15: v156.16,7.76 v156.16,11.22 156.5,11.22 157.47,12.19 157.47,32.76 v134.97,55.26 | v20.15,62.12 87.74,62.12 88.29,62.67 88.57,62.67 v90.09,61.15
SRC  (via drill 0.3)
  Top 0.15: C4.2 93.9,31.72 92.52,31.72 89.68,34.56 84.14,34.56 D5.2 84.14,34.49 84.14,33.31 82.48,31.65 L1.1 82.41,31.58 v82.41,30.4 | v71.53,21.95 69.6,20.01 Q3.3
  Bottom 0.15: v71.53,21.95 73.82,21.95 77.14,25.28 77.28,25.28 v82.41,30.4
SS_SD  (via drill 0.3)
  Top 0.15: v13.71,100.48 11.56,100.48 R10.1 | v15.03,100 15.79,99.23 D8.2 | v10.25,51.87 11.63,50.48 11.63,45.77 U2.4 | v7.41,87.88 7.06,88.22 6.23,88.22 J4.P2
  Bottom 0.15: v15.03,100 14.54,100.48 v13.71,100.48 13.71,100.41 10.25,96.95 10.25,87.88 | 10.25,87.88 v10.25,51.87 | 10.25,87.88 v7.41,87.88
TX
  Top 0.15: U2.25 11.63,63.29 11.63,63.5 5.54,69.6 3.81,69.6 TX.TP
USB_D+
  Top 0.3: D1.3 148.82,48.89 148.4,48.89 138.57,58.72 138.57,65.03 137.53,66.06 93.76,66.06 89.33,61.63 88.29,61.63 88.09,61.42 88.09,60.25 87.88,60.04 87.67,60.04 87.32,59.69 87.32,57.62 74.65,44.94 25.14,44.94 24.38,45.7 U2.14
USB_D-
  Top 0.3: D1.1 148.82,50.76 148.82,55.4 137.46,66.76 92.03,66.76 89.68,69.11 89.68,80.19 88.64,81.23 75.62,81.23 39.82,45.43 26.32,45.43 24.93,46.81 23.82,46.81 23.13,46.12 23.13,45.77 U2.13
VBAT
  Top 0.3: 126.94,57.76 126.94,58.17 C2_BAT.1 | 126.94,57.76 123.96,54.78 MCP73831.3 | Q1.3 130.4,51.38 130.4,52.77 131.78,54.15 132.06,54.15 U4.3 132.2,54.22 132.2,54.64 U4.2 132.06,54.71 131.78,54.71 131.51,54.98 131.51,55.4 | 131.51,55.4 136.84,60.73 136.84,64.4 VBAT.TP | 126.94,57.76 127.07,57.69 127.56,57.69 129.77,55.47 131.37,55.47 131.51,55.4
VBUS  (via drill 0.3)
  Top 0.3: v152.28,51.31 152.63,51.66 153.04,51.66 C4_USB.1 | v152.28,50.28 151.87,49.86 151.38,49.86 D1.5 | 143.35,50.62 144.04,50.62 C5_USB.1 | 143.35,50.62 143.28,50.62 | 143.28,50.62 131.37,50.62 130.05,49.31 129.43,49.31 Q1.1 129.29,49.17 126.66,49.17 121.47,43.97 115.37,43.97 D2.2 | v143.28,50.76 143.28,50.62 | 143.35,50.62 143.35,48.89 147.29,44.94 147.29,43.21 PFMF.050.1.2 | R1_PWRUSB.2 113.08,43.28 114.82,43.28 115.23,43.7 D2.2 | 115.23,53.95 116.2,53.95 CHG_LED.A 116.34,54.02 116.62,54.02 117.31,54.71 121.26,54.71 MCP73831.4 121.39,54.85 129.91,63.36 129.91,64.4 VBUS.TP | 115.23,53.95 111.7,53.95 111.01,54.64 C1_BAT.1 | 115.23,53.95 115.23,43.84 D2.2
  Bottom 0.3: v152.28,50.28 152.28,50.76 | 152.28,50.76 v152.28,51.31 | v143.28,50.76 152.28,50.76
VRTC  (via drill 0.3)
  Top 0.3: 88.64,57.41 88.64,50.07 88.02,49.44 U3.14 88.09,49.31 88.09,48.89 88.92,48.06 93.69,48.06 94.46,48.82 95.91,48.82 C10_SUPERCAP.2 | 88.64,57.41 88.64,59.76 88.71,59.83 88.71,60.8 R_CAPACITOR.1 | v91.2,59.21 93.63,59.21 C8.1 | v88.78,57.41 88.64,57.41
  Bottom 0.3: v91.2,59.21 90.58,59.21 v88.78,57.41
VUSB
  Top 0.3: J2.A9 163.36,56.78 163.36,56.58 J2.B4 163.5,56.51 164.05,56.51 164.61,55.95 164.61,52.63 164.05,52.08 163.5,52.08 J2.B9 163.36,52.01 163.36,51.8 J2.A4 163.22,51.73 160.45,51.73 151.87,43.14 PFMF.050.1.1